# EAGLE design macplus (EAGLE 9.6.1)
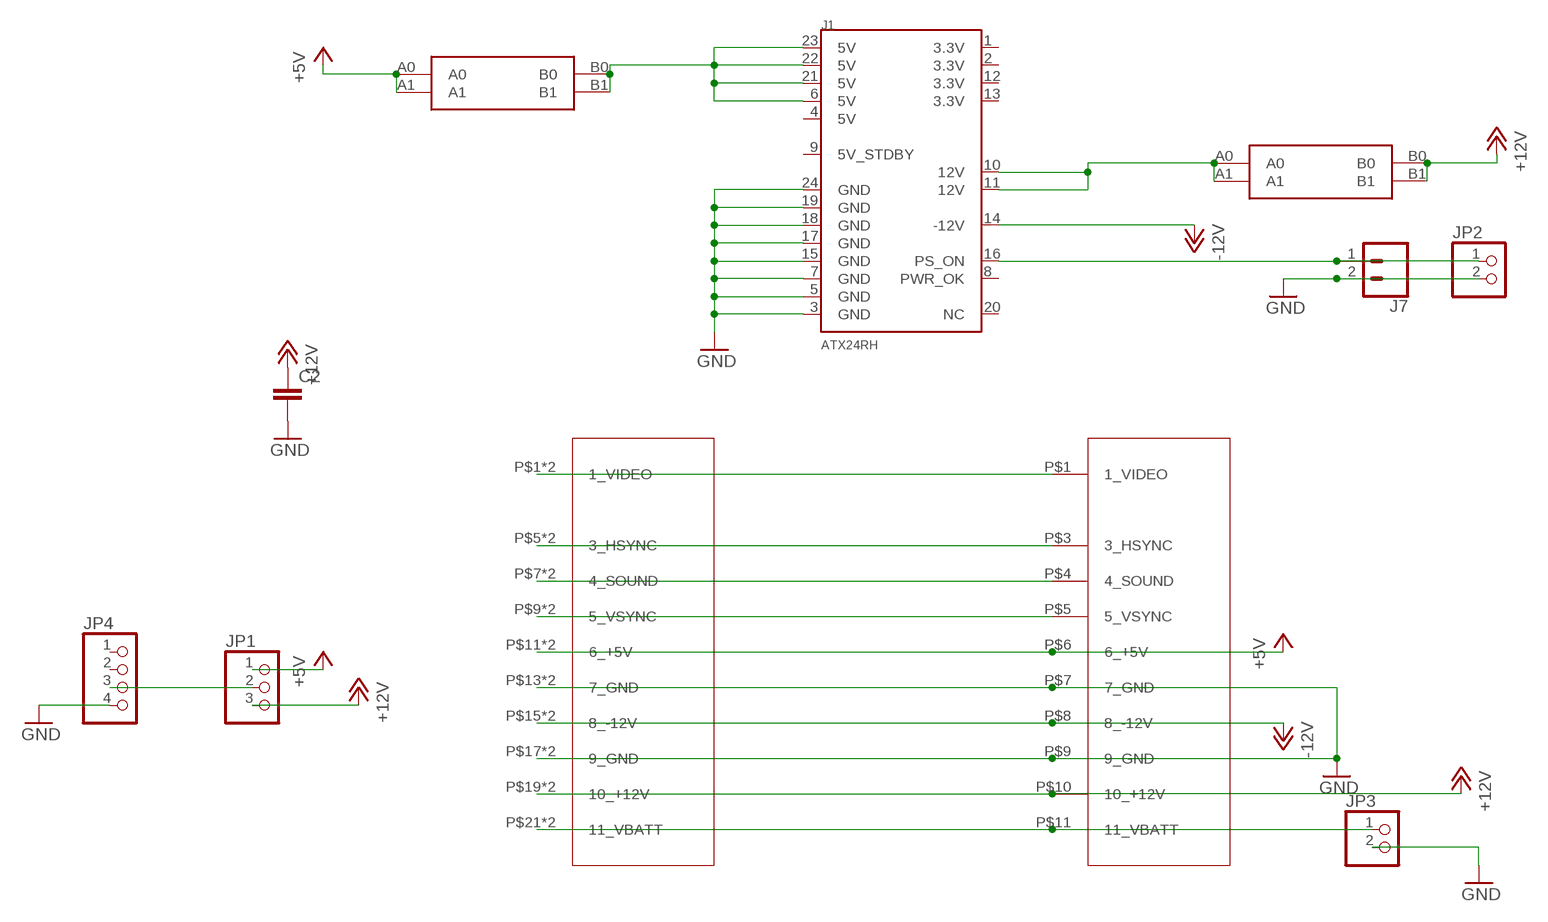
[diagram p0: schematic, sheet 1]

## Parts
C2  C5/2.5  [C5B2.5]
J1  ATX24RH  [ATX24_STRAIGHT]
J7  CONN_023.5MM-NO_SILK  [SCREWTERMINAL-3.5MM-2-NS]
JP1  PINHD-1X3  [1X03]
JP2  PINHD-1X2  [1X02]
JP3  PINHD-1X2  [1X02]
JP4  PINHD-1X4  [1X04]
U$1  MACPLUS  [396_10P]
U$2  CAR_FUSE_HOLDER3IN1  [FUSE_HOLDER_3IN1]
U$3  3.96_FEM  [3.96_FEMALE_GAP]
U$8  CAR_FUSE_HOLDER3IN1  [FUSE_HOLDER_3IN1]

## Nets
+5V: JP1.1 U$1.P$6(6_+5V) U$3.P$11(6_+5V) U$3.P$12(6_+5V) U$8.A0 U$8.A1
+12V: C2.1 JP1.3 U$1.P$10(10_+12V) U$2.B0 U$2.B1 U$3.P$19(10_+12V) U$3.P$20(10_+12V)
-12V: J1.14(-12V) U$1.P$8(8_-12V) U$3.P$15(8_-12V) U$3.P$16(8_-12V)
GND: C2.2 J1.3(GND) J1.5(GND) J1.7(GND) J1.15(GND) J1.17(GND) J1.18(GND) J1.19(GND) J1.24(GND) J7.2 JP2.2 JP3.2 JP4.4 U$1.P$7(7_GND) U$1.P$9(9_GND) U$3.P$13(7_GND) U$3.P$14(7_GND) U$3.P$17(9_GND) U$3.P$18(9_GND)
N$1: U$1.P$1(1_VIDEO) U$3.P$1(1_VIDEO) U$3.P$2(1_VIDEO)
N$2: U$1.P$3(3_HSYNC) U$3.P$5(3_HSYNC) U$3.P$6(3_HSYNC)
N$3: U$1.P$4(4_SOUND) U$3.P$7(4_SOUND) U$3.P$8(4_SOUND)
N$4: U$1.P$5(5_VSYNC) U$3.P$9(5_VSYNC) U$3.P$10(5_VSYNC)
N$5: J1.16(PS_ON) J7.1 JP2.1
N$6: J1.6(5V) J1.21(5V) J1.22(5V) J1.23(5V) U$8.B0 U$8.B1
N$7: JP1.2 JP4.3
N$8: J1.10(12V) J1.11(12V) U$2.A0 U$2.A1
N$10: JP3.1 U$1.P$11(11_VBATT) U$3.P$21(11_VBATT) U$3.P$22(11_VBATT)
Unconnected: J1.1(3.3V) J1.2(3.3V) J1.4(5V) J1.8(PWR_OK) J1.9(5V_STDBY) J1.12(3.3V) J1.13(3.3V) J1.20(NC) JP4.1 JP4.2

## Library data of the parts
C2 = capacitor-wima:C: CAPACITOR naming: grid - package width
J1 = atx4vc:ATX24: ATX24 Pin Power Supply Connector This is a good connector for connecting a computer power supply to a PCB. It's massive, but provides many amps of power at 5V and 12V. SKU: PRT-09498
J7 = atx_power_control:CONN_02: Multi connection point. Often used as Generic Header-pin footprint for 0.1 inch spaced/style header connections On any of the 0.1 inch spaced packages, you can populate with these: Break Away Headers - Straight <https://www.sparkfun.com/products/116> (PRT-00116) Break Away Male Headers - Right Angle <https://www.sparkfun.com/products/553> (PRT-00553) Female Headers <https://www.sparkfun.com/products/115> (PRT-00115) Break Away Headers - Machine Pin <https://www.sparkfun.com/products/117> (PRT-00117) Break Away Female Headers - Swiss Machine Pin <https://www.sparkfun.com/products/743> (PRT-00743) For SCREWTERMINALS and SPRING TERMINALS visit here: Screw Terimnals on SparkFun.com <https://www.sparkfun.com/search/results?term=Screw+Terminals> (5mm/3.5mm/2.54mm spacing) This device is also useful as a general connection point to wire up your design to another part of your project. Our various solder wires solder well into these plated through hole pads. Hook-Up Wire - Assortment (Stranded, 22 AWG) <https://www.sparkfun.com/products/11375> (PRT-11375) Hook-Up Wire - Assortment (Solid Core, 22 AWG) <https://www.sparkfun.com/products/11367> (PRT-11367) View the entire wire category on our website here <https://www.sparkfun.com/categories/141> Special notes: Molex polarized connector foot print use with: PRT-08233 with associated crimp pins and housings. 2.54_SCREWTERM for use with PRT-10571. 3.5mm Screw Terminal footprints for PRT-08084 5mm Screw Terminal footprints for use with PRT-08432; PROD_ID: CONN-13512; SF_ID: PRT-09918; SF_SKU: PRT-08432; SKU: PRT-09914
JP1 = pinhead:PINHD-1X3: PIN HEADER
JP2 JP3 = pinhead:PINHD-1X2: PIN HEADER
JP4 = atx_power_control:PINHD-1X4: PIN HEADER
U$1 = 396_conn:MACPLUS
U$2 U$8 = atx_power_control:CAR_FUSE_HOLDER
U$3 = atx4vc:3.96_FEM

## Board
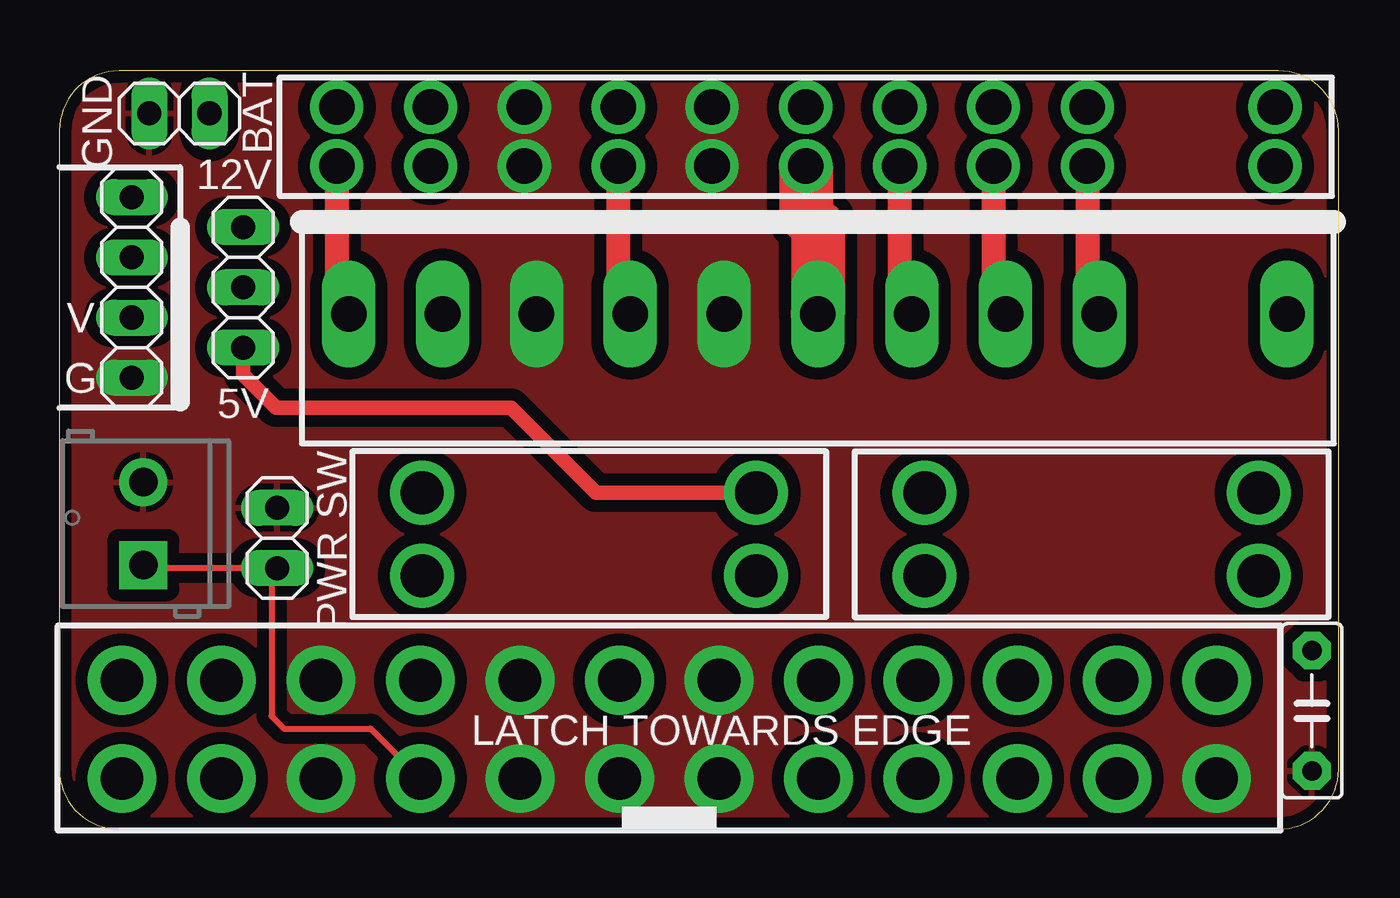
[diagram p1: board, top side]
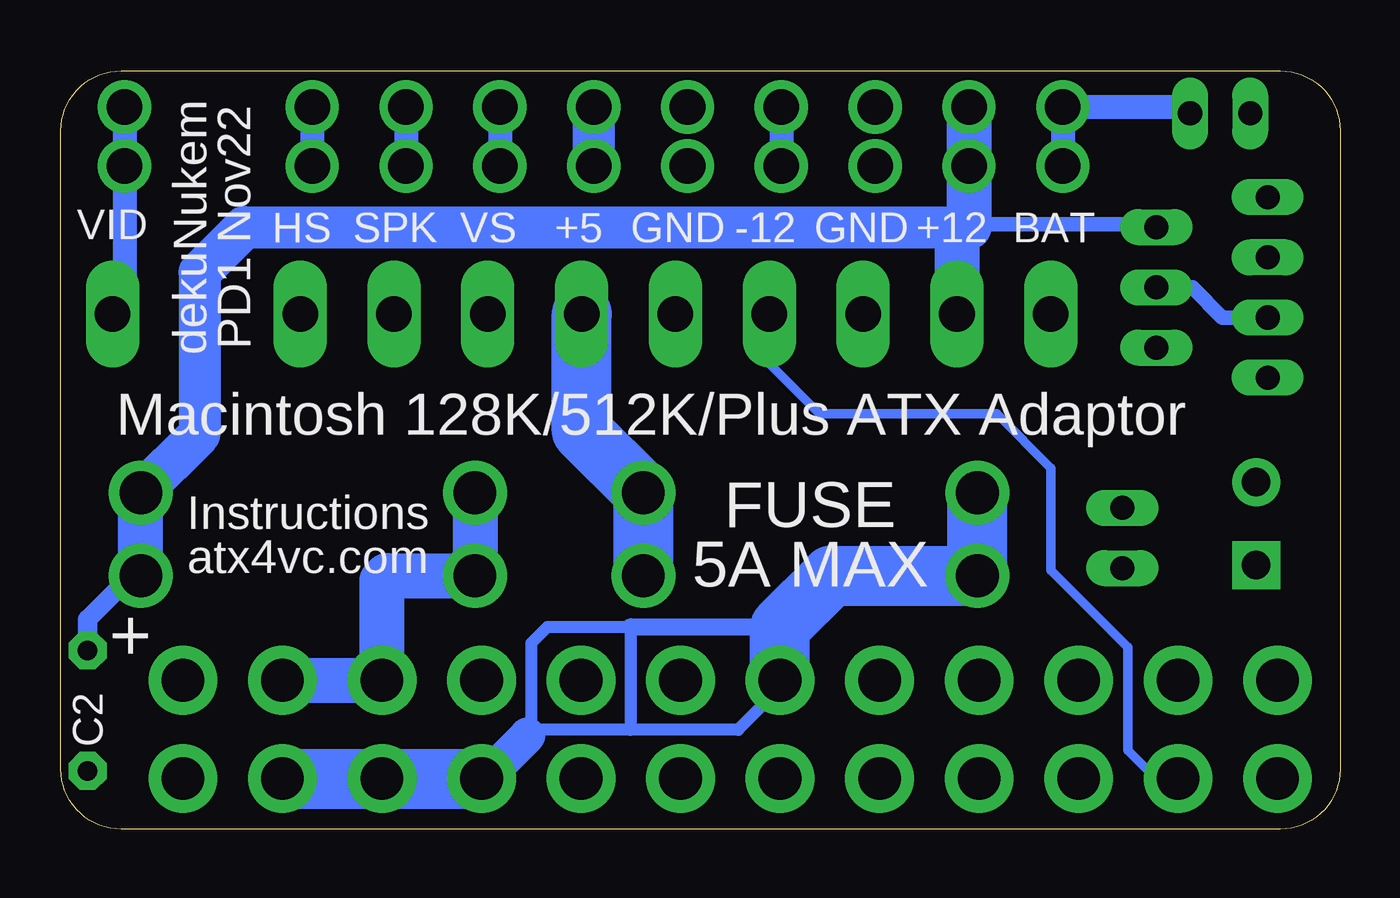
[diagram p2: board, bottom side, seen from below]

Size 54 x 32 mm. Coordinates in mm from the lower left corner, seen from the top.
Outline: 54,2.54 54,29.46 arc90 51.46,32 2.54,32 arc90 0,29.46 0,2.54 arc90 2.54,0 51.46,0 arc90 54,2.54
Copper layers (1*16): Top 0.035mm / dielectric 1.5mm / Bottom 0.035mm
Design rules "deku_2layer_6mil *": minimum track width 6mil, minimum drill 15mil, track to track 20mil, track to pad 6mil, pad to pad 6mil, via to via 6mil, smd to smd 6mil, copper to edge 10mil, drill to drill 6mil, minimum pad ring 7mil, minimum via ring 7mil, stop-mask expansion 4mil, vias tented up to drill 25mil, thermal gap 10mil

### Footprints (pad centres in the part's own frame; a part is rotated, then mirrored left to right if it is on the bottom)
C5B2.5 = drill 0.813 pad 1.6 octagon: 1 -2.54,0; 2 2.54,0
ATX24_STRAIGHT = drill 1.8 pad 2.9: 1 23.1,-2.05; 2 18.9,-2.05; 3 14.7,-2.05; 4 10.5,-2.05; 5 6.3,-2.05; 6 2.1,-2.05; 7 -2.1,-2.05; 8 -6.3,-2.05; 9 -10.5,-2.05; 10 -14.7,-2.05; 11 -18.9,-2.05; 12 -23.1,-2.05; 13 23.1,2.1; 14 18.9,2.1; 15 14.7,2.1; 16 10.5,2.1; 17 6.3,2.1; 18 2.1,2.1; 19 -2.1,2.1; 20 -6.3,2.1; 21 -10.5,2.1; 22 -14.7,2.1; 23 -18.9,2.1; 24 -23.1,2.1
SCREWTERMINAL-3.5MM-2-NS = drill 1.2 pad 2.032 square: 1 0,0 | drill 1.2 pad 2.032: 2 3.5,0
1X03 = drill 1.016 long: 1 -2.54,0; 2 0,0; 3 2.54,0
1X02 = drill 1.016 long: 1 -1.27,0; 2 1.27,0
1X04 = drill 1.016 long: 1 -3.81,0; 2 -1.27,0; 3 1.27,0; 4 3.81,0
396_10P = drill 1.5 long: P$1 19.8,0; P$3 11.88,0; P$4 7.92,0; P$5 3.96,0; P$6 0,0; P$7 -3.96,0; P$8 -7.92,0; P$9 -11.88,0; P$10 -15.84,0; P$11 -19.8,0
FUSE_HOLDER_3IN1 = drill 1.8: A0 -7.05,1.75; A1 -7.05,-1.75; B0 7.05,1.75; B1 7.05,-1.75
3.96_FEMALE_GAP = drill 1.5: P$1 19.8,-1.25; P$2 19.8,1.25; P$5 11.88,-1.25; P$6 11.88,1.25; P$7 7.92,-1.25; P$8 7.92,1.25; P$9 3.96,-1.25; P$10 3.96,1.25; P$11 0,-1.25; P$12 0,1.25; P$13 -3.96,-1.25; P$14 -3.96,1.25; P$15 -7.92,-1.25; P$16 -7.92,1.25; P$17 -11.88,-1.25; P$18 -11.88,1.25; P$19 -15.84,-1.25; P$20 -15.84,1.25; P$21 -19.8,-1.25; P$22 -19.8,1.25

### Placement (x,y rotation side)
C2  52.87,5 270 top
J1  25.75,4.24 180 top
J7  3.55,11.14 90 top
JP1  7.76,22.86 90 top
JP2  9.2,12.29 90 top
JP3  5.07,30.2 180 top
JP4  3.06,22.86 270 top
U$1  32.02,21.73 0 top
U$2  43.58,12.45 0 top
U$3  31.51,29.23 0 top
U$8  22.37,12.45 180 top

### Tracks (layer width: path | path; a pad name or v marks a point on that pad's centre or on a via)
+5V
  Top 0.61: U$8.A1 22.65,14.2 19.07,17.78 9.16,17.78 7.76,19.18 JP1.1
  Top 1.905: 32.02,25.44 31.51,25.94
  Top 2.286: U$3.P$11 31.51,25.94 | 32.02,25.44 U$1.P$6
  Bottom 1.778: U$3.P$12 U$3.P$11
  Bottom 2.54: U$8.A0 U$8.A1 32.02,16.8 U$1.P$6
+12V
  Bottom 0.61: 16.18,25.4 16.05,25.53 7.89,25.53 JP1.3
  Bottom 0.813: U$2.B1 51.04,10.7 52.87,8.87 C2.1
  Bottom 1.778: U$2.B0 48.15,16.67 48.15,23.5 46.24,25.4 16.18,25.4 15.67,25.4
  Bottom 1.905: U$2.B1 U$2.B0 | 16.18,25.4 U$1.P$10 | U$3.P$20 U$3.P$19 15.67,25.4
-12V
  Top 1.016: U$3.P$15 23.59,22.24 U$1.P$8
  Bottom 0.406: U$1.P$8 24.1,19.64 21.99,17.53 14.49,17.53 12.21,15.24 12.21,10.92 8.96,7.67 8.96,3.33 7.77,2.14 J1.14
  Bottom 1.016: U$3.P$16 U$3.P$15
GND
  pour Top (isolate 0.508): 54,2.54 54,29.46 arc90 51.46,32 2.54,32 arc90 0,29.46 0,0 51.46,0 arc90
N$1
  Bottom 1.016: U$3.P$2 U$3.P$1 51.31,22.24 U$1.P$1
N$2
  Top 1.016: U$3.P$5 43.39,22.24 U$1.P$3
  Bottom 1.016: U$3.P$6 U$3.P$5
N$3
  Top 1.016: U$3.P$7 39.43,22.24 U$1.P$4
  Bottom 1.016: U$3.P$8 U$3.P$7
N$4
  Top 1.016: U$3.P$9 35.47,22.24 U$1.P$5
  Bottom 1.016: U$3.P$10 U$3.P$9
N$5
  Top 0.254: J7.1 3.67,11.02 JP2.1 8.96,10.78 8.96,4.78 9.49,4.24 13.14,4.24 J1.16
N$6
  Bottom 0.508: 29.96,4.19 25.42,4.19 23.65,5.96 J1.6 | 29.91,8.53 33.47,8.53 34.15,7.85 34.15,4.23 | 29.96,8.53 29.96,4.19 | 34.15,4.23 34.31,4.08 | 29.96,4.19 34.11,4.19 34.15,4.23
  Bottom 0.711: 29.96,8.53 29.91,8.53 23.65,8.53
  Bottom 1.27: 34.31,4.08 34.31,3.95 | 36.12,2.14 J1.21
  Bottom 1.524: 36.12,2.14 34.31,3.95
  Bottom 2.54: J1.23 J1.22 J1.21 | J1.6 23.65,8.53 21.48,10.7 U$8.B0 U$8.B1
N$7
  Bottom 0.61: JP1.2 6.24,22.86 4.97,21.59 JP4.3
N$8
  Bottom 1.905: J1.11 J1.10 40.45,10.5 40.25,10.7 U$2.A1 U$2.A0
N$10
  Top 1.016: U$3.P$21 11.71,22.24 U$1.P$11
  Bottom 1.016: U$3.P$21 U$3.P$22 6.62,30.48 JP3.1

### Text on the board
tNames: GND | BAT | 12V | V | G | 5V | PWR SW | LATCH TOWARDS EDGE
bNames: VID | BAT | +12 | GND | -12 | GND | +5 | VS | SPK | HS | dekuNukem / PD1 Nov22 | Macintosh 128K/512K/Plus ATX Adaptor | FUSE / 5A MAX | Instructions / atx4vc.com | +